# EasyEDA Pro project ProPrj_ESP32DIV-SHIELD-pcb mod1_2025-07-15.epro

# Board ESP32DIV-SHIELD-pcb
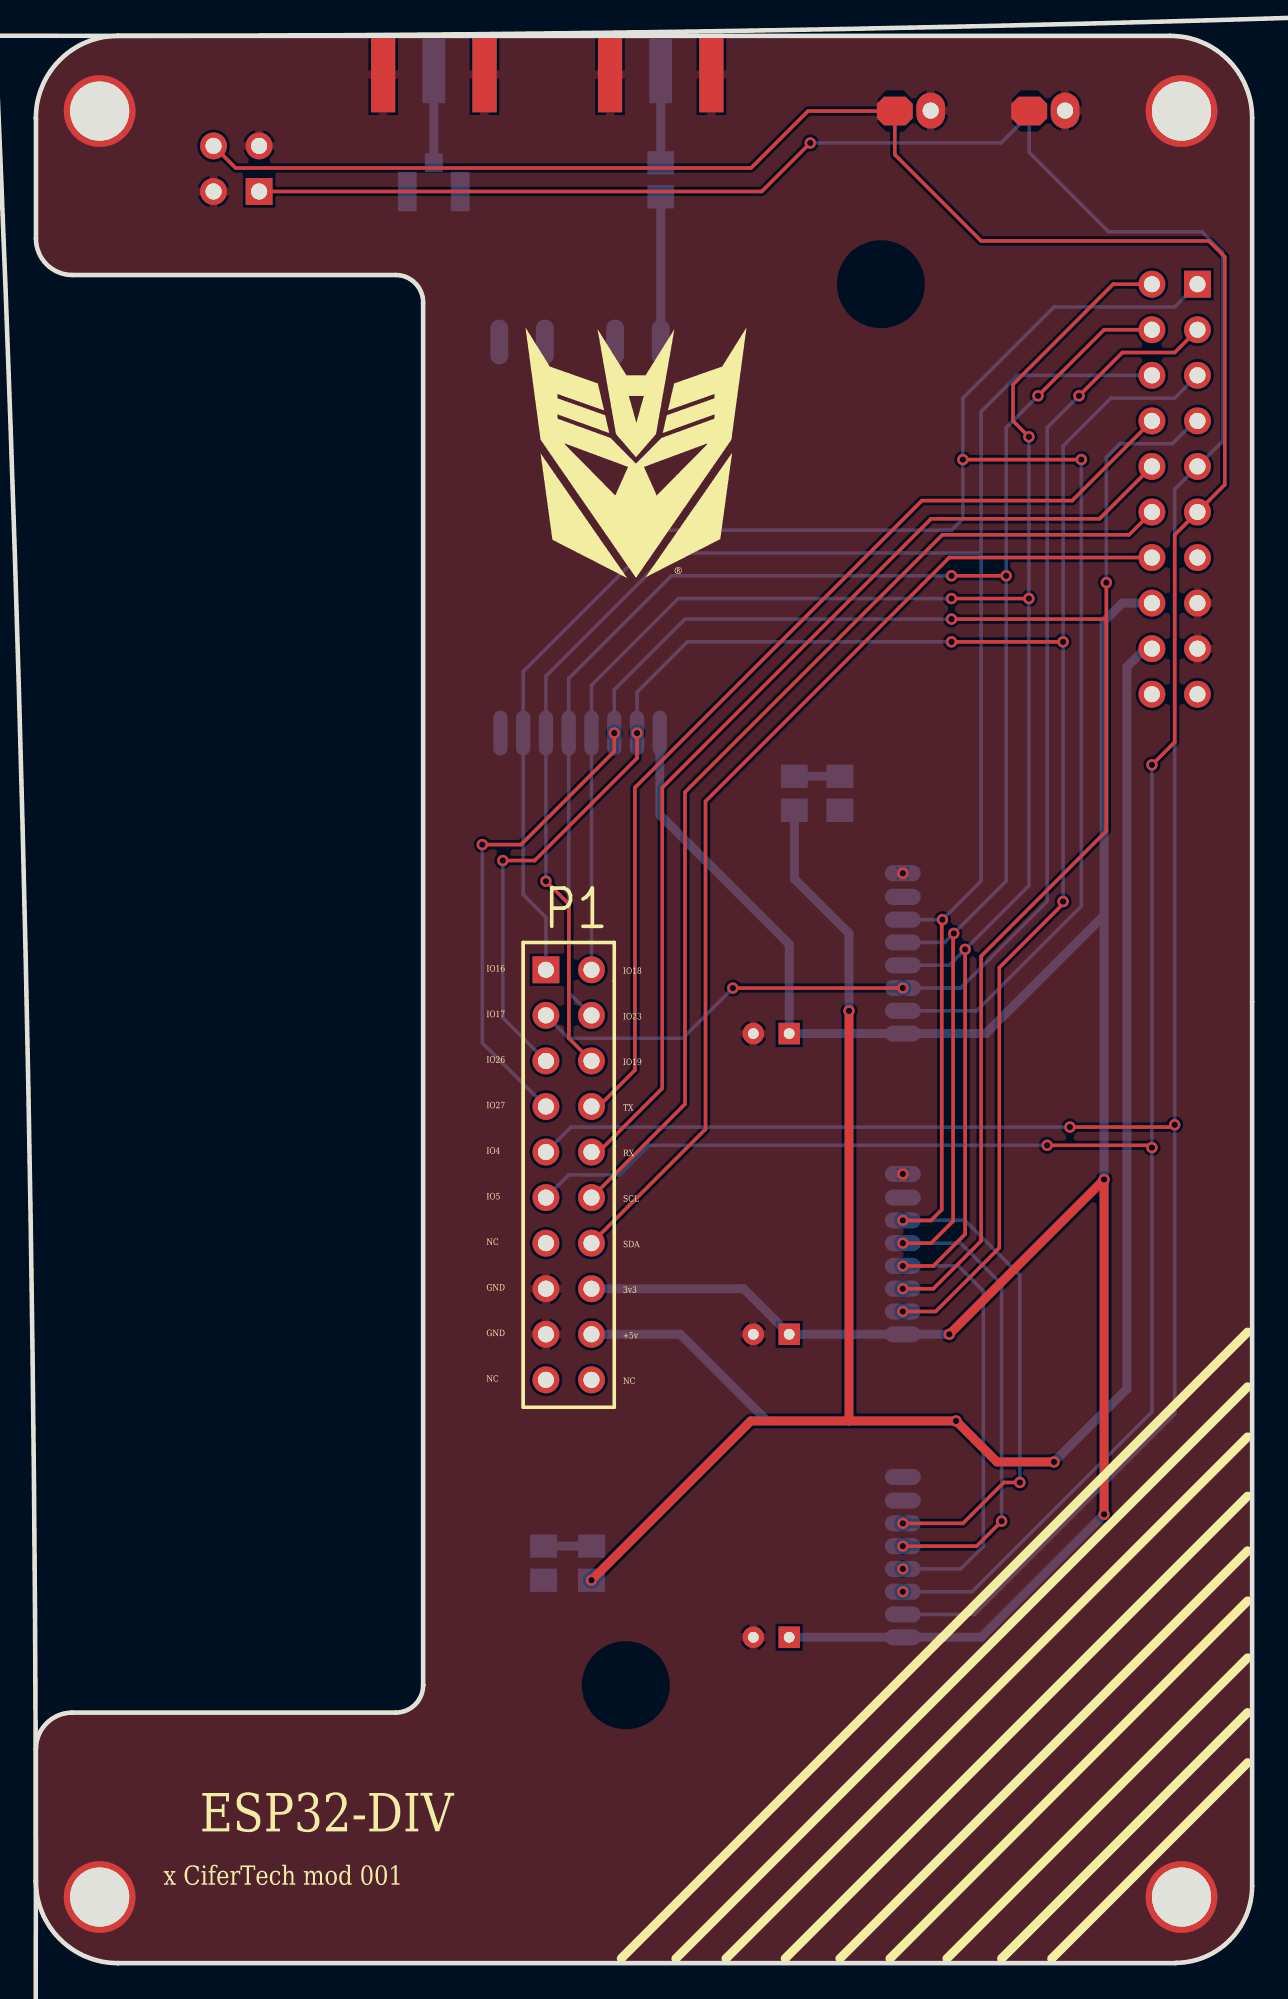
[diagram p0: board, top side]
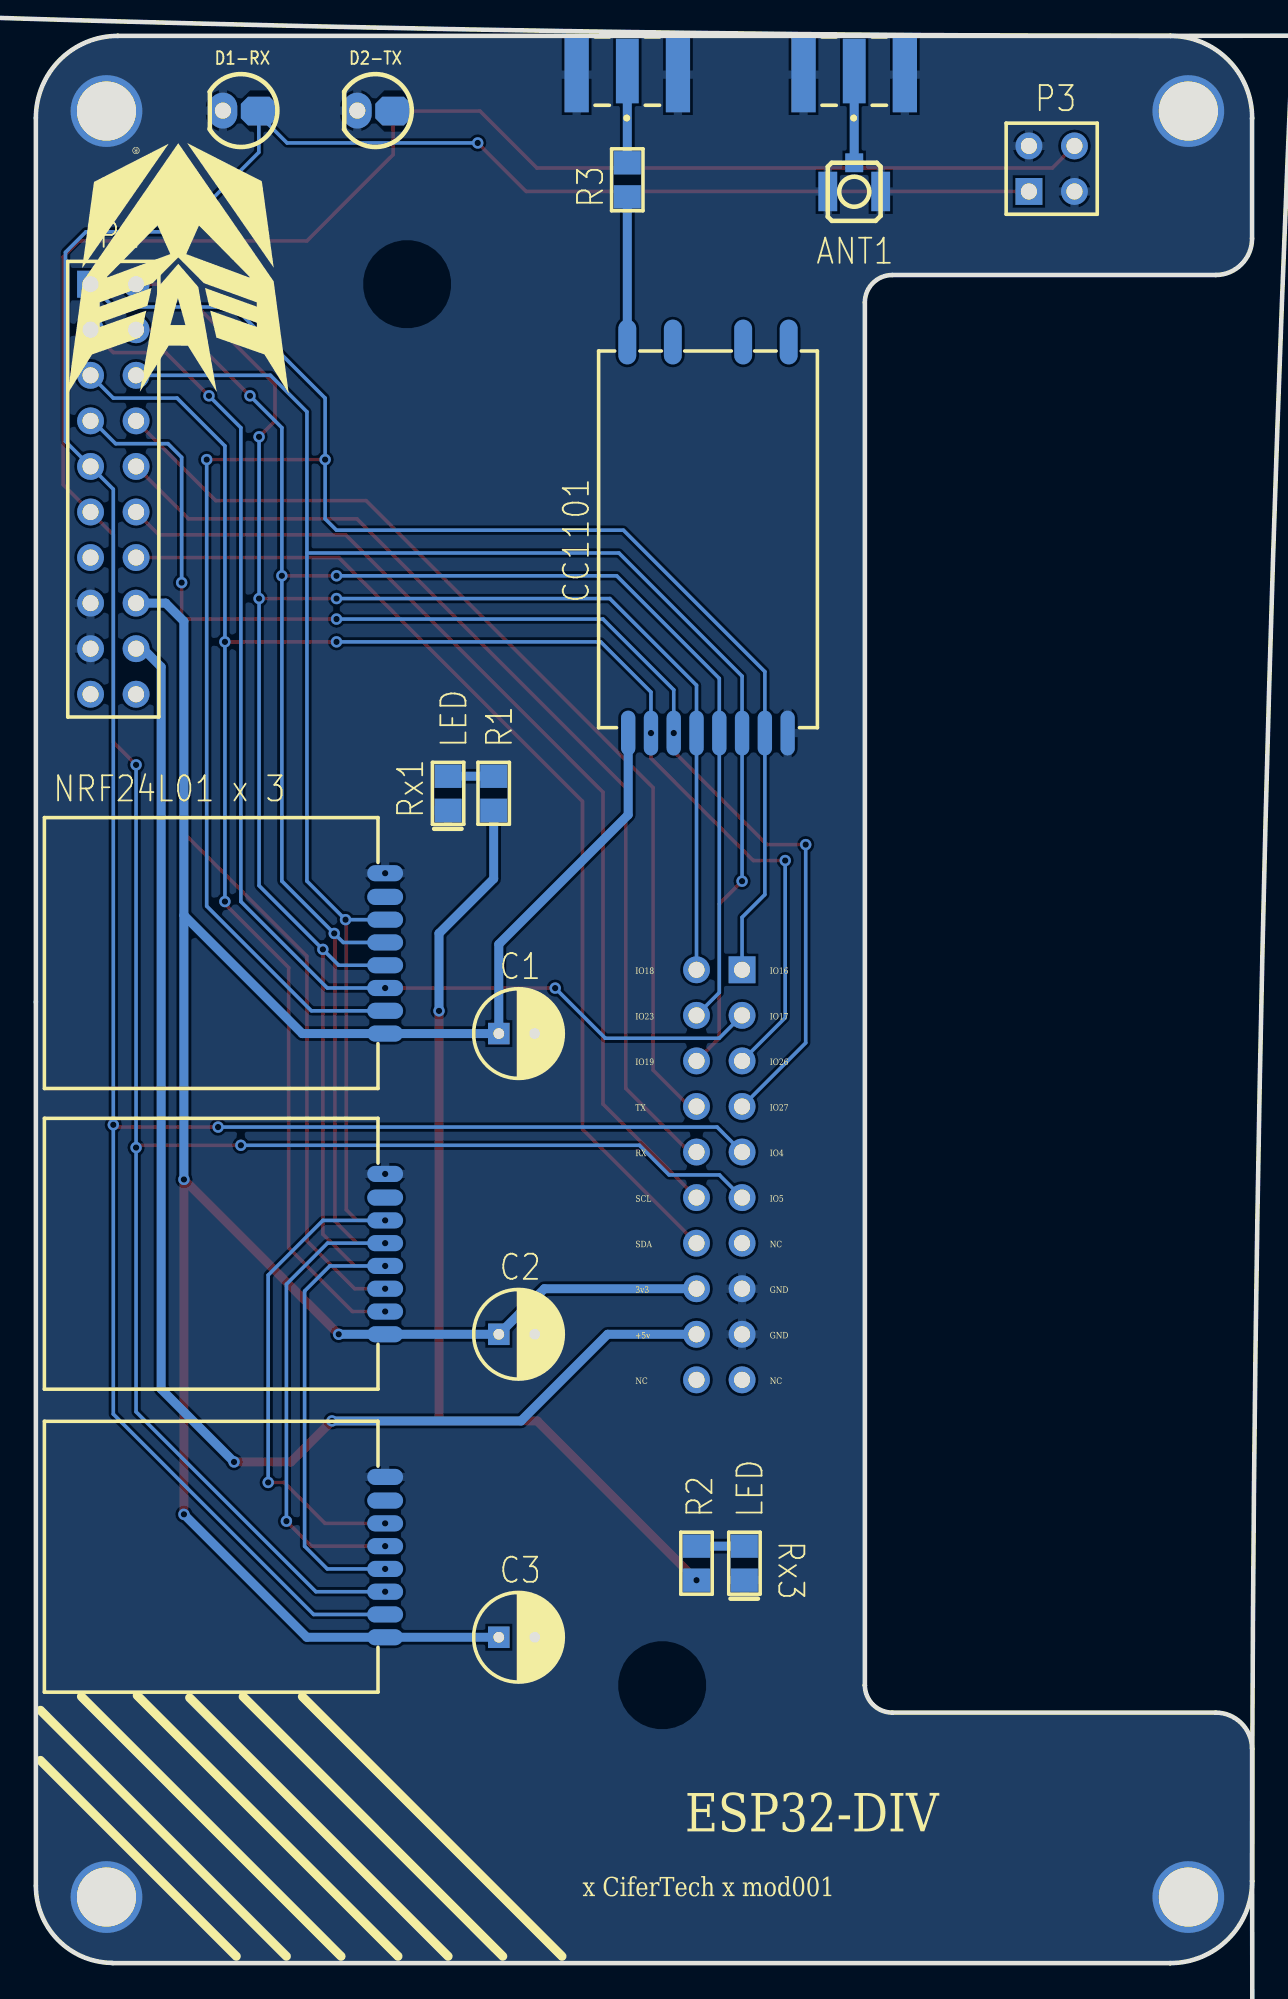
[diagram p1: board, bottom side, seen from below]

Outline 67.82 x 107.44 mm; copper layers: Top Layer, Bottom Layer. Coordinates in mm from the lower left corner of the outline.
Outline path: 4.57,107.44 arc(1.34,106.1) 0,102.87 arc(0,102.85) 0,102.83 0,96.14 arc(0.6,94.71) 2.03,94.11 20.07,94.11 arc(21.15,93.66) 21.59,92.58 21.59,15.49 ; 4.57,107.44 arc(4.57,107.44) 4.57,107.44 arc(4.57,107.44) 4.57,107.44 ; 4.57,107.44 63.25,107.44 arc(63.25,107.44) 63.25,107.44 arc(66.48,106.1) 67.82,102.87 67.82,4.31 arc(66.59,1.3) 63.6,0.01 arc(63.56,0) 63.52,0 4.57,0 arc(1.34,1.34) 0,4.57 0,11.94 arc(0,11.96) 0,11.99 arc(0.62,13.39) 2.03,13.97 20.07,13.97 arc(21.15,14.41) 21.59,15.49 ; 21.59,15.49 arc(21.59,15.49) 21.59,15.49 ; 21.59,15.49 arc(21.59,15.49) 21.59,15.49
Stack: Top Layer 0.0356mm / Dielectric 1 0.32mm FR-4 er 4.8 / Bottom Layer 0.0356mm

## Design rules (mm)
net U1: ESP32DIV-SHIELD-sch
net U2: ESP32DIV-SHIELD-sch
net U3: ESP32DIV-SHIELD-sch
net U4: ESP32DIV-SHIELD-sch
net D1: ESP32DIV-SHIELD-sch
net D2: ESP32DIV-SHIELD-sch
net J1: ESP32DIV-SHIELD-sch
net J2: ESP32DIV-SHIELD-sch
net R1: ESP32DIV-SHIELD-sch
net R2: ESP32DIV-SHIELD-sch
net Rx1: ESP32DIV-SHIELD-sch
net Rx2: ESP32DIV-SHIELD-sch
net P3: ESP32DIV-SHIELD-sch
net P2: ESP32DIV-SHIELD-sch
net P1: ESP32DIV-SHIELD-sch
net R3: ESP32DIV-SHIELD-sch
net ANT1: ESP32DIV-SHIELD-sch
net C3: Inside Board Components
net C2: Inside Board Components
net C1: Inside Board Components
spacing Clearance (default): track to track 0.254, other pairs 0 to 0.254
track width Width (default): min 0.2, default 0.2, max 1
differential pair DiffPairsRouting (default): width min 0.381, default 0.381, max 0.381; gap min 0.254, default 0.254
via RoutingVias (default): diameter min 1.27, default 1.27, max 1.27; hole min 0.711, default 0.711, max 0.711

## Placement (name value [footprint] x y rotation side)
ANT1  ANT U.FL  [U.FL SMD]  22.19 99.57 0 bottom
C1  100uF50V  [Cap electrolitic radial 5x11-2]  41.01 51.82 180 bottom
C2  100uF50V  [Cap electrolitic radial 5x11-2]  41.01 35.06 180 bottom
C3  100uF50V  [Cap electrolitic radial 5x11-2]  41.01 18.17 180 bottom
D1  LED IR-R  [LED 3mm BLACK]  56.39 103.26 0 bottom
D2  LED IR-S  [LED 3mm]  48.9 103.26 0 bottom
J1  SMA  [SAMTEC_SMA-J-P-H-ST-EM1]  34.84 105.48 0 bottom
J2  SMA  [SAMTEC_SMA-J-P-H-ST-EM1]  22.19 105.48 0 bottom
NOREF  -  [Pad_e11]  63.88 103.25 0 top
NOREF#2  -  [Pad_e6]  3.56 103.25 0 top
NOREF#3  -  [Pad_e13]  63.88 3.68 0 top
NOREF#4  -  [Pad_e12]  3.56 3.68 0 top
P1  -  [M-Header 10X2]  -17.28 128.53 270 top
P2  -  [N-Header 10X2]  110.49 166.75 270 bottom
P3  Header 2X2  [HDR2X2]  12.45 98.77 180 bottom
R1  1k  [RES 0805]  42.29 64.27 180 bottom
R2  1k  [RES 0805]  30.98 21.35 180 bottom
R3  0R  [RES 0805]  34.84 100.37 0 bottom
Rx1  LED  [L0805]  44.83 64.27 270 bottom
Rx2  LED  [L0805]  28.31 21.35 270 bottom
U1  CC1101  [CC1101_SMD]  30.34 79.38 180 bottom
U2  NRF24L01  [NRF24L01_GT24MINI_MS]  58.04 22.61 0 bottom
U3  NRF24L01  [NRF24L01_GT24MINI_MS]  58.04 39.5 0 bottom
U4  NRF24L01  [NRF24L01_GT24MINI_MS]  58.04 56.26 0 bottom

## Footprints (pads in the part's own frame, mm; a bottom-side part is the same pattern mirrored in y, then rotated)
Cap electrolitic radial 5x11-2
  rect 1.2x1.2 hole 0.6: 1(-1,0)
  round 1.2 hole 0.6: 2(1,0)
CC1101_SMD
  oval 0.8x2.5 smd: 1(-4.45,-10.8) 2(-3.18,-10.8) 3(-1.91,-10.8) 4(-0.64,-10.8) 5(0.63,-10.8) 6(1.9,-10.8) 7(3.17,-10.8) 8(4.44,-10.8)
  oval 1x2.5 smd: 9(-4.5,11) 10(-1.96,11) 11(1.96,11) 12(4.5,11)
HDR2X2
  rect 1.5x1.5 hole 0.9: 1(0,0)
  round 1.5 hole 0.9: 2(0,2.54) 3(2.54,0) 4(2.54,2.54)
L0805
  rect 1.3x1.5 smd: A(-1.9,0) K(0,0)
LED 3mm
  custom 2x1.6 hole 0.9: A(-1,0.013)
  oval 1.6x2 hole 0.9: K(1,-0.013)
LED 3mm BLACK
  custom 2x1.6 hole 0.9: A(-1,0.013)
  oval 1.6x2 hole 0.9: K(1,-0.013)
M-Header 10X2
  rect 1.5x1.5 hole 0.9: 1(73.152,45.72)
  round 1.5 hole 0.9: 2(73.152,48.26) 3(75.692,45.72) 4(75.692,48.26) 5(78.232,45.72) 6(78.232,48.26) 7(80.772,45.72) 8(80.772,48.26) 9(83.312,45.72) 10(83.312,48.26) 11(85.852,45.72) 12(85.852,48.26) 13(88.392,45.72) 14(88.392,48.26) 15(90.932,45.72) 16(90.932,48.26) 17(93.472,45.72) 18(93.472,48.26) 19(96.012,45.72) 20(96.012,48.26)
N-Header 10X2
  rect 1.5x1.5 hole 0.9: 1(73.152,45.72)
  round 1.5 hole 0.9: 2(73.152,48.26) 3(75.692,45.72) 4(75.692,48.26) 5(78.232,45.72) 6(78.232,48.26) 7(80.772,45.72) 8(80.772,48.26) 9(83.312,45.72) 10(83.312,48.26) 11(85.852,45.72) 12(85.852,48.26) 13(88.392,45.72) 14(88.392,48.26) 15(90.932,45.72) 16(90.932,48.26) 17(93.472,45.72) 18(93.472,48.26) 19(96.012,45.72) 20(96.012,48.26)
NRF24L01_GT24MINI_MS
  oval 2x0.9 smd: 1(-9.7,4.44) 2(-9.7,3.17) 3(-9.7,1.9) 4(-9.7,0.63) 5(-9.7,-0.64) 6(-9.7,-1.91) 7(-9.7,-3.18) 8(-9.7,-4.5)
Pad_e6
  round 4 hole 3.3: 1(0,0)
Pad_e11
  round 4 hole 3.3: 1(0,0)
Pad_e12
  round 4 hole 3.3: 1(0,0)
Pad_e13
  round 4 hole 3.3: 1(0,0)
RES 0805
  rect 1.5x1.3 smd: 1(0,0) 2(0,1.9)
SAMTEC_SMA-J-P-H-ST-EM1
  rect 1.27x3.6 smd: 1(0,0)
  rect 1.35x4.2 smd: 2_1(-2.825,0.2) 3_1(2.825,0.2)
  rect 1.35x4.2 smd far side: 2_2(-2.825,0.2) 3_2(2.825,0.2)
U.FL SMD
  rect 1x1.05 smd: 1(0.002,-0.8)
  rect 1.05x2.2 smd: 2(-1.475,0.8) 2(1.475,0.8)

## Nets
3V3: C1.1 C2.1 C3.1 P1.16 P2.16 U1.1 U2.1 U3.1 U4.1
+5V: P1.18 P2.18 R1.1 R2.1
GND: ANT1.2 C1.2 C2.2 C3.2 D1.K D2.K J1.2_1 J1.2_2 J1.3_1 J1.3_2 J2.2_1 J2.2_2 J2.3_1 J2.3_2 P1.15 P1.17 P2.15 P2.17 P3.2 P3.3 Rx1.K Rx2.K U1.8 U2.8 U3.8 U4.8
ANT: R3.2 U1.9
IO4: D1.A P1.9 P2.9 P3.1 U2.2
IO5: D2.A P1.11 P2.11 P3.4 U2.3
IO16: P1.1 P2.1 U1.7 U4.2
IO17: P1.3 P2.3 U4.3
IO18: P1.2 P2.2 U1.4 U2.4 U3.4 U4.4
IO19: P1.6 P2.6 U1.6 U2.6 U3.6 U4.6
IO23: P1.4 P2.4 U1.5 U2.5 U3.5 U4.5
IO26: P1.5 P2.5 U1.2 U3.2
IO27: P1.7 P2.7 U1.3 U3.3
NETANT1_1: ANT1.1 J2.1
NETJ1_1: J1.1 R3.1
NETR1_2: R1.2 Rx1.A
NETR2_2: R2.2 Rx2.A
RX_0: P1.10 P2.10
SCL: P1.12 P2.12
SDA: P1.14 P2.14
TX_0: P1.8 P2.8

Pads without a net: NOREF 1; NOREF#2 1; NOREF#3 1; NOREF#4 1; P1 13 19 20; P2 13 19 20; U1 10 11 12; U2 7; U3 7; U4 7

## Via types
v1: diameter 0.635, hole 0.356, Top Layer to Bottom Layer, 50 vias

## Routing (per net, layer and track width the routed paths; a pad name or vN(x,y) marks a point on that pad's centre or on a via; arc(x,y) is an arc through that point)
3V3: length 146.5
  Top Layer w0.5: v1(59.56,25.02) v1(59.56,43.69) v1(50.93,35.06)
  Bottom Layer w0.5: 59.56,58.42 59.56,74.8 60.58,75.82 62.23,75.82 ; 59.56,58.42 52.96,51.82 U4.1 C1.1 42.01,56.8 34.79,64.02 U1.1 ; 59.56,58.42 v1(59.56,43.69) ; v1(50.93,35.06) U3.1 C2.1 39.47,37.6 30.98,37.6 ; v1(59.56,25.02) 52.71,18.17 U2.1 C3.1
+5V: length 136
  Top Layer w0.5: 45.34,30.23 v1(45.34,53.09) ; 45.34,30.23 39.86,30.23 v1(30.98,21.35) ; 45.34,30.23 v1(51.31,30.23) 53.59,27.94 v1(56.77,27.94)
  Bottom Layer w0.5: 30.98,35.06 31.1,35.18 31.22,35.06 35.94,35.06 40.77,30.23 v1(51.31,30.23) ; P2.18 61.85,73.28 60.83,72.26 60.83,32 v1(56.77,27.94) ; v1(45.34,53.09) 45.34,57.4 42.29,60.45 R1.1
GND:
  vias: v1(48.34,60.76) v1(48.34,44)
ANT: length 8.1
  Bottom Layer w0.5: U1.9 R3.2
IO4: length 181.5
  Top Layer w0.2: v1(57.66,46.61) 63.37,46.61 v1(63.5,46.74) ; P3.1 40.48,98.77 v1(43.18,101.47)
  Bottom Layer w0.2: v1(57.66,46.61) 29.83,46.61 28.44,45.22 ; U2.2 52.33,19.44 63.5,30.61 v1(63.5,46.74) 63.5,82.17 66.17,84.84 66.17,95.38 65.02,96.52 59.82,96.52 55.39,100.95 55.39,103.05 ; 55.39,103.05 53.81,101.47 v1(43.18,101.47) ; 55.39,103.05 D1.A
IO5: length 182.2
  Top Layer w0.2: v1(62.23,45.47) 62.1,45.59 v1(56.39,45.59) ; v1(62.23,66.8) 63.5,68.07 63.5,79.63 66.29,82.42 66.29,95.12 65.41,96.01 52.71,96.01 47.9,100.82 D2.A 43.05,103.25 39.88,100.08 11.14,100.08 9.91,101.31
  Bottom Layer w0.2: 28.44,42.68 29.71,43.94 32.51,43.94 34.16,45.59 v1(56.39,45.59) ; v1(62.23,66.8) v1(62.23,45.47) 62.23,30.73 52.2,20.71 v1(48.34,20.71)
IO16: length 111.5
  Top Layer w0.2: v1(51.69,83.82) v1(58.29,83.82)
  Bottom Layer w0.2: 28.44,55.38 28.44,58.3 27.17,59.57 U1.7 27.17,72 35.05,79.88 51.05,79.88 51.69,80.52 v1(51.69,83.82) 51.69,87.25 56.77,92.33 63.5,92.33 P2.1 ; U4.2 52.46,53.09 58.29,58.93 v1(58.29,83.82)
IO17: length 68.8
  Top Layer w0.2: P2.3 63.5,89.79 60.58,89.79 v1(58.17,87.38) ; v1(38.86,54.36) 38.87,54.36 48.34,54.36 v1(48.34,54.36)
  Bottom Layer w0.2: v1(48.34,54.36) 51.57,54.36 56.39,59.18 56.39,85.6 v1(58.17,87.38) ; 28.44,52.84 28.57,52.84 28.57,52.71 29.72,51.56 36.07,51.56 v1(38.86,54.36)
IO18: length 133.9
  Top Layer w0.2: v1(55.37,85.09) 54.48,85.98 54.48,88.01 60.07,93.6 P2.2 ; v1(51.82,56.52) 51.82,40.64 50.04,38.87 v1(48.34,38.87) ; v1(51.05,76.07) v1(55.37,76.07)
  Bottom Layer w0.2: v1(48.34,21.98) 51.57,21.98 52.83,23.24 52.83,37.47 51.43,38.87 v1(48.34,38.87) ; v1(55.37,85.09) 55.37,60.07 v1(51.82,56.52) 50.93,55.63 U4.4 ; 30.98,55.38 30.98,71.24 35.81,76.07 v1(51.05,76.07)
IO19: length 136.8
  Top Layer w0.2: v1(54.86,26.8) 53.98,26.8 51.69,24.52 v1(48.34,24.52) ; 30.98,50.3 29.72,51.56 29.72,59.04 v1(28.44,60.32) ; v1(48.34,41.41) 48.35,41.4 49.91,41.4 50.51,42 50.51,58.13 v1(50.55,58.17)
  Bottom Layer w0.2: U4.6 v1(50.55,58.17) 52.71,60.33 52.71,78.61 ; P2.6 54.74,88.52 52.71,86.49 52.71,78.61 ; v1(54.86,26.8) 54.86,38.35 51.81,41.41 v1(48.34,41.41) ; 52.71,78.61 35.31,78.61 28.44,71.75 U1.6 v1(28.44,60.32)
IO23: length 134.1
  Top Layer w0.2: v1(51.18,57.4) 51.15,57.37 51.15,41.37 49.92,40.14 v1(48.34,40.14) ; P2.4 59.56,91.06 v1(55.88,87.38) ; v1(53.85,24.64) 52.46,23.25 v1(48.34,23.25) ; v1(51.05,77.34) v1(54.1,77.34) ; 30.86,52.84 30.98,52.84
  Bottom Layer w0.2: 30.98,52.84 29.71,54.11 U1.5 29.71,71.62 35.43,77.34 v1(51.05,77.34) ; v1(48.34,40.14) 51.56,40.14 53.85,37.85 v1(53.85,24.64) ; v1(55.88,87.38) 54.1,85.6 54.1,60.33 v1(51.18,57.4) 50.68,56.9 U4.5
IO26: length 112.8
  Top Layer w0.2: v1(57.28,59.18) 57.28,59.06 53.72,55.5 53.72,39.88 50.17,36.33 v1(48.34,36.33) ; v1(33.52,68.58) 33.52,67.18 27.81,61.47 v1(26.04,61.47) ; v1(51.05,73.66) v1(57.28,73.66)
  Bottom Layer w0.2: 28.44,50.3 26.04,52.7 v1(26.04,61.47) ; v1(51.05,73.66) 36.32,73.66 33.52,70.86 v1(33.52,68.58) ; P2.5 63.5,87.25 59.94,87.25 57.28,84.58 v1(57.28,73.66) v1(57.28,59.18)
IO27: length 116.1
  Top Layer w0.2: v1(48.34,37.6) 50.04,37.6 52.71,40.26 52.71,56.13 59.69,63.12 59.69,74.93 ; v1(24.89,62.36) 27.05,62.36 32.25,67.56 v1(32.25,68.58) ; 59.69,74.93 v1(59.69,76.96) ; 59.69,74.93 v1(51.05,74.93)
  Bottom Layer w0.2: v1(59.69,76.96) 59.69,83.95 60.45,84.71 63.37,84.71 64.64,85.98 64.77,85.98 ; 28.44,47.76 24.89,51.31 v1(24.89,62.36) ; v1(51.05,74.93) 36.2,74.93 32.25,70.99 v1(32.25,68.58)
NETANT1_1: length 5.1
  Bottom Layer w0.5: ANT1.1 J2.1
NETJ1_1: length 5.1
  Bottom Layer w0.5: R3.1 J1.1
NETR1_2: length 2.5
  Bottom Layer w0.5: R1.2 Rx1.A
NETR2_2: length 2.7
  Bottom Layer w0.5: Rx2.A R2.2
RX_0: length 56.9
  Top Layer w0.2: 30.98,45.22 31.37,45.22 34.93,48.77 34.93,65.53 49.91,80.52 59.31,80.52 62.23,83.44
SCL: length 57.3
  Top Layer w0.2: 30.98,42.68 36.2,47.89 36.2,65.28 50.55,79.63 60.96,79.63 62.23,80.9
SDA: length 57.8
  Top Layer w0.2: P2.14 50.93,78.36 37.34,64.77 37.34,46.5 30.98,40.14
TX_0: length 56.3
  Top Layer w0.2: 62.23,85.98 57.79,81.53 49.4,81.53 33.4,65.53 33.4,49.78 31.37,47.76 30.98,47.76

## Copper pours and planes (outline as drawn; the poured copper is in the pictures)
GND on Top Layer: 0,4.57 1.34,1.34 4.57,0 63.52,0 63.56,0 63.6,0.01 66.59,1.3 67.82,4.31 67.82,102.87 66.48,106.1 63.25,107.44 4.57,107.44 1.34,106.1 0,102.87 0,102.83 0,96.14 0.6,94.71 2.03,94.11 20.07,94.11 21.15,93.66 21.59,92.58 21.59,15.49 21.15,14.41 20.07,13.97 2.03,13.97 0.62,13.39 0,11.99 0,11.94
GND on Bottom Layer: 0,4.57 1.34,1.34 4.57,0 63.52,0 63.56,0 63.6,0.01 66.59,1.3 67.82,4.31 67.82,102.87 66.48,106.1 63.25,107.44 4.57,107.44 1.34,106.1 0,102.87 0,102.83 0,96.14 0.6,94.71 2.03,94.11 20.07,94.11 21.15,93.66 21.59,92.58 21.59,15.49 21.15,14.41 20.07,13.97 2.03,13.97 0.62,13.39 0,11.99 0,11.94

## Text on the board
Bottom Silkscreen Layer: D2-TX | D1-RX | P3 | ANT1 | C1 | C2 | C3 | P2 | NRF24L01 x 3 | LED | R1 | Rx1 | R2 | R3 | Rx3 | CC1101 | IO16 | IO17 | IO26 | IO27 | IO4 | IO5 | NC | GND | IO18 | IO23 | IO19 | TX | RX | SCL | SDA | 3v3 | +5v | x CiferTech x mod001 | ESP32-DIV
Component Marking Layer: Rx2
Top Silkscreen Layer: P1 | IO16 | IO17 | IO26 | IO27 | IO4 | IO5 | NC | GND | IO18 | IO23 | IO19 | TX | RX | SCL | SDA | 3v3 | +5v | x CiferTech mod 001 | ESP32-DIV
